# Altium schematic sheet 09 Peripherral.SchDoc
size A3
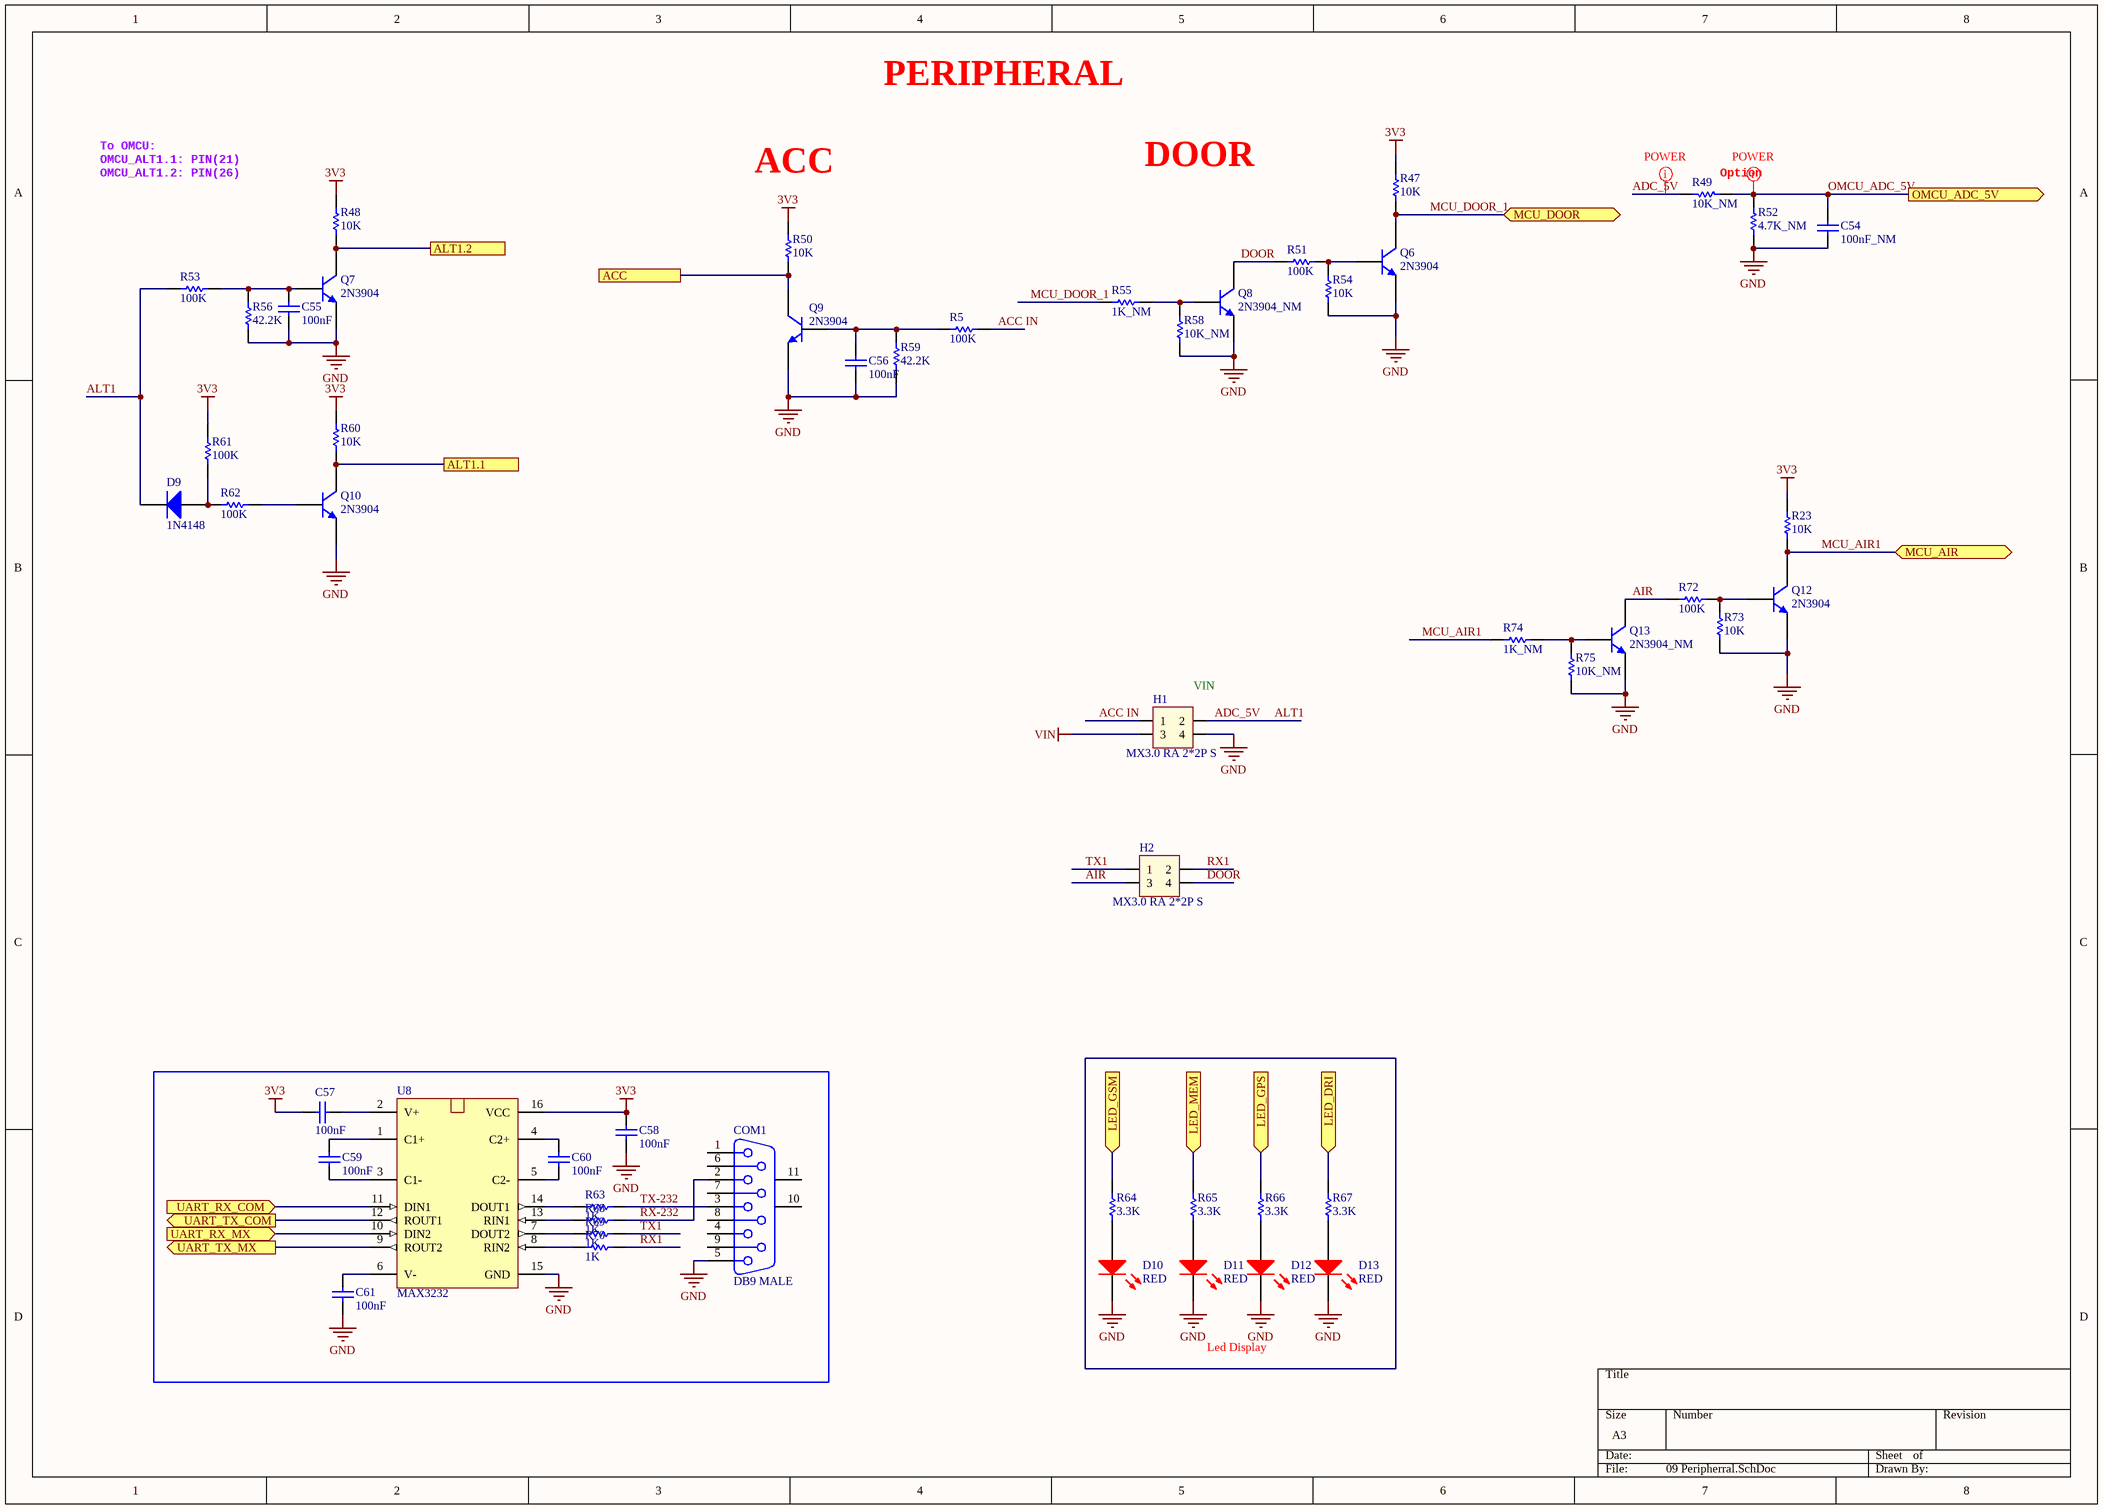
[diagram p0: 09 Peripherral.SchDoc]

## Parts
C54  100nF_NM  [0603 - C]
C55  100nF  [0603 - C]
C56  100nF  [0603 - C]
C57  100nF  [0603 - C]
C58  100nF  [0603 - C]
C59  100nF  [0603 - C]
C60  100nF  [0603 - C]
C61  100nF  [0603 - C]
COM1  DB9 MALE  [DSB 9M-SM]
D9  1N4148  [SOD-123]
D10  RED  [LED - 0603 - R]
D11  RED  [LED - 0603 - R]
D12  RED  [LED - 0603 - R]
D13  RED  [LED - 0603 - R]
H1  MX3.0 RA 2*2P S  [43045-M3045-2x2-B]
H2  MX3.0 RA 2*2P S  [43045-M3045-2x2-B]
Q6  2N3904  [SOT23B]
Q7  2N3904  [SOT23B]
Q8  2N3904_NM  [SOT23B]
Q9  2N3904  [SOT23B]
Q10  2N3904  [SOT23B]
Q12  2N3904  [SOT23B]
Q13  2N3904_NM  [SOT23B]
R5  100K  [0603 - R]
R23  10K  [0603 - R]
R47  10K  [0603 - R]
R48  10K  [0603 - R]
R49  10K_NM  [0603 - R]
R50  10K  [0603 - R]
R51  value 100K  [0603 - R]  (hidden comment: 1K)
R52  4.7K_NM  [0603 - R]
R53  100K  [0603 - R]
R54  10K  [0603 - R]
R55  value 1K_NM  [0603 - R]  (hidden comment: 1K)
R56  value 42.2K  [0603 - R]  (hidden comment: 61.2K)
R58  value 10K_NM  [0603 - R]  (hidden comment: 10K)
R59  value 42.2K  [0603 - R]  (hidden comment: 61.2K)
R60  10K  [0603 - R]
R61  100K  [0603 - R]
R62  100K  [0603 - R]
R63  1K  [0603 - R]
R64  3.3K  [0603 - R]
R65  3.3K  [0603 - R]
R66  3.3K  [0603 - R]
R67  3.3K  [0603 - R]
R68  1K  [0603 - R]
R69  1K  [0603 - R]
R70  1K  [0603 - R]
R72  value 100K  [0603 - R]  (hidden comment: 1K)
R73  10K  [0603 - R]
R74  value 1K_NM  [0603 - R]  (hidden comment: 1K)
R75  value 10K_NM  [0603 - R]  (hidden comment: 10K)
U8  MAX3232  [SOIC16]

## Ports
ACC, ALT1.1, ALT1.2, LED_DRI (in), LED_GPS (in), LED_GSM (in), LED_MEM (in), MCU_AIR (bidir), MCU_DOOR (bidir), OMCU_ADC_5V (out), UART_RX_COM (in), UART_RX_MX (in), UART_TX_COM (out), UART_TX_MX (out)

## Nets
3V3: C57.2 C58.2 R23.2 R47.2 R48.2 R50.2 R60.2 R61.2 U8.16(VCC)
GND: C54.1 C55.1 C56.1 C58.1 C61.1 COM1.5 D10.2(K) D11.2(K) D12.2(K) D13.2(K) H1.4 Q6.2(E) Q7.2(E) Q8.2(E) Q9.2(E) Q10.2(E) Q12.2(E) Q13.2(E) R52.1 R54.1 R56.1 R58.1 R59.1 R73.1 R75.1 U8.15(GND)
VIN: H1.3
ACC: Q9.3(C) R50.1 ; port ACC
ACC IN: H1.1 R5.2
ADC_5V: D9.2(K) H1.2 R49.2 R53.2  [also labelled ALT1]
AIR: H2.3 Q13.3(C) R72.2
ALT1.1: Q10.3(C) R60.1 ; port ALT1.1
ALT1.2: Q7.3(C) R48.1 ; port ALT1.2
DOOR: H2.4 Q8.3(C) R51.2
LED_DRI: R67.2 ; port LED_DRI
LED_GPS: R66.2 ; port LED_GPS
LED_GSM: R64.2 ; port LED_GSM
LED_MEM: R65.2 ; port LED_MEM
MCU_AIR1: Q12.3(C) R23.1 R74.1 ; port MCU_AIR
MCU_DOOR_1: Q6.3(C) R47.1 R55.1 ; port MCU_DOOR
OMCU_ADC_5V: C54.2 R49.1 R52.2 ; port OMCU_ADC_5V
RX1: H2.2 R70.2
RX-232: COM1.2 R68.2
TX1: H2.1 R69.2
TX-232: COM1.3 R63.2
UART_RX_COM: U8.11(DIN1) ; port UART_RX_COM
UART_RX_MX: U8.10(DIN2) ; port UART_RX_MX
UART_TX_COM: U8.12(ROUT1) ; port UART_TX_COM
UART_TX_MX: U8.9(ROUT2) ; port UART_TX_MX
NetC55_2: C55.2 Q7.1(B) R53.1 R56.2
NetC56_2: C56.2 Q9.1(B) R5.1 R59.2
NetC57_1: C57.1 U8.2(V+)
NetC59_1: C59.1 U8.3(C1-)
NetC59_2: C59.2 U8.1(C1+)
NetC60_1: C60.1 U8.5(C2-)
NetC60_2: C60.2 U8.4(C2+)
NetC61_2: C61.2 U8.6(V-)
NetD9_1: D9.1(A) R61.1 R62.1
NetD10_1: D10.1(A) R64.1
NetD11_1: D11.1(A) R65.1
NetD12_1: D12.1(A) R66.1
NetD13_1: D13.1(A) R67.1
NetQ6_1: Q6.1(B) R51.1 R54.2
NetQ8_1: Q8.1(B) R55.2 R58.2
NetQ10_1: Q10.1(B) R62.2
NetQ12_1: Q12.1(B) R72.1 R73.2
NetQ13_1: Q13.1(B) R74.2 R75.2
NetR63_1: R63.1 U8.14(DOUT1)
NetR68_1: R68.1 U8.13(RIN1)
NetR69_1: R69.1 U8.7(DOUT2)
NetR70_1: R70.1 U8.8(RIN2)

Not connected (* = marked no-connect by the designer): COM1 1 4 6 7 8 9 10(MH1) 11(MH2)

## Layout directives
net class POWER: ADC_5V, OMCU_ADC_5V

## Notes on the sheet
- PERIPHERAL
- OMCU_ALT1.1: PIN(21)
- OMCU_ALT1.2: PIN(26)
- To OMCU:
- ACC
- DOOR
- (near R49) Option
- (near H1) VIN
- Led Display

## Library data of the parts
C54-C61 = Cap 0603 100nF: CAP CER 100nF 50V C0G/NP0 0603 ±5%; MPN: CL10C104JB8NNNC; MFR: SAMSUNG; Company ID: VT_CAP_C0603 100nF; Voltage: 50V; Package: 0603; Size: C0603: 100nF
  C54: Value: 100nF_NM
  C55-C61: Value: 100nF
COM1 = DB9M S: CONN D-SUB PLUG 9POS PNL MNT; MPN: 772-E09-103R001; MFR: Norcomp Inc.; Company ID: VT_CONN_DB9 male, thẳng
D9 = Diode 1N4148: DIODE GEN PURP 100V 300MA SOD123; MPN: 1N4148W-7-F; MFR: DIODES; Company ID: VT_DIODE_1N4148W-7-F
D10-D13 = LED 0603 RED: LED RED CLEAR 0603 SMD; MFR: Everlight; MPN: QTLP601CRTR; Company ID: VT_LED_0603 RED; Size: LED 0603 - RED
H1 H2 = HD2x2 S: Micro-Fit 3.0™ Straight Header, 3.00mm Pitch, Dual Row, 4 Circuits; MPN: M3045-2x2-B; MFR: China; Company ID: VT_CONN_2*2 (M3045); MPN2: 43045-
Q6-Q10 Q12 Q13 = Transistor 2N3904: TRANS NPN 40V 0.2A SOT-23; MPN: MMBT3904; MFR: Fairchild; Company ID: VT_TRANSISTOR_3904
R5 R51 R53 R61 R62 R72 = Res 0603 100K: RES SMD 100K OHM 1% 1/10W 0603; MFR: Yageo; MPN: RC0603FR-07100KL; Company ID: VT_RES_R0603 100K; Size: R0603: 100K
  R5 R53 R61 R62: Value: 100K
R23 R47-R50 R54 R58 R60 R73 R75 = Res 0603 10K: RES SMD 10K OHM 1% 1/10W 0603; MFR: Yageo; MPN: RC0603FR-0710KL; Company ID: VT_RES_R0603 10K; Size: R0603: 10K
  R23 R47 R48 R50 R54 R60 R73: Value: 10K
  R49: Value: 10K_NM
R52 = Res 0603 4.7K: RES SMD 4.7K OHM 1% 1/10W 0603; MFR: Yageo; MPN: RC0603FR-074K7L; Company ID: VT_RES_R0603 4.7K; Size: R0603: 4.7K; Value: 4.7K_NM
R55 R63 R68-R70 R74 = Res 0603 1K: RES SMD 1K OHM 1% 1/10W 0603; MFR: Yageo; MPN: RC0603FR-071KL; Company ID: VT_RES_R0603 1K; Size: R0603: 1K
  R63 R68-R70: Value: 1K
R56 R59 = Res 0603 42.2K: RES SMD 42K2 OHM 1% 1/10W 0603; MFR: Yageo; MPN: RC0603FR-0742K2L; Company ID: VT_RES_R0603 42K2; Size: R0603: 42K2
R64-R67 = Res 0603 3.3K: RES SMD 3.3K OHM 1% 1/10W 0603; MFR: Yageo; MPN: RC0603FR-073K3L; Company ID: VT_RES_R0603 3.3K; Value: 3.3K; Size: R0603: 3.3K
U8 = MAX3232: 2/2 Transceiver Full RS232 16-SOIC; MPN: MAX3232EIDR; MFR: TI; Company ID: VT_IC_MAX3232